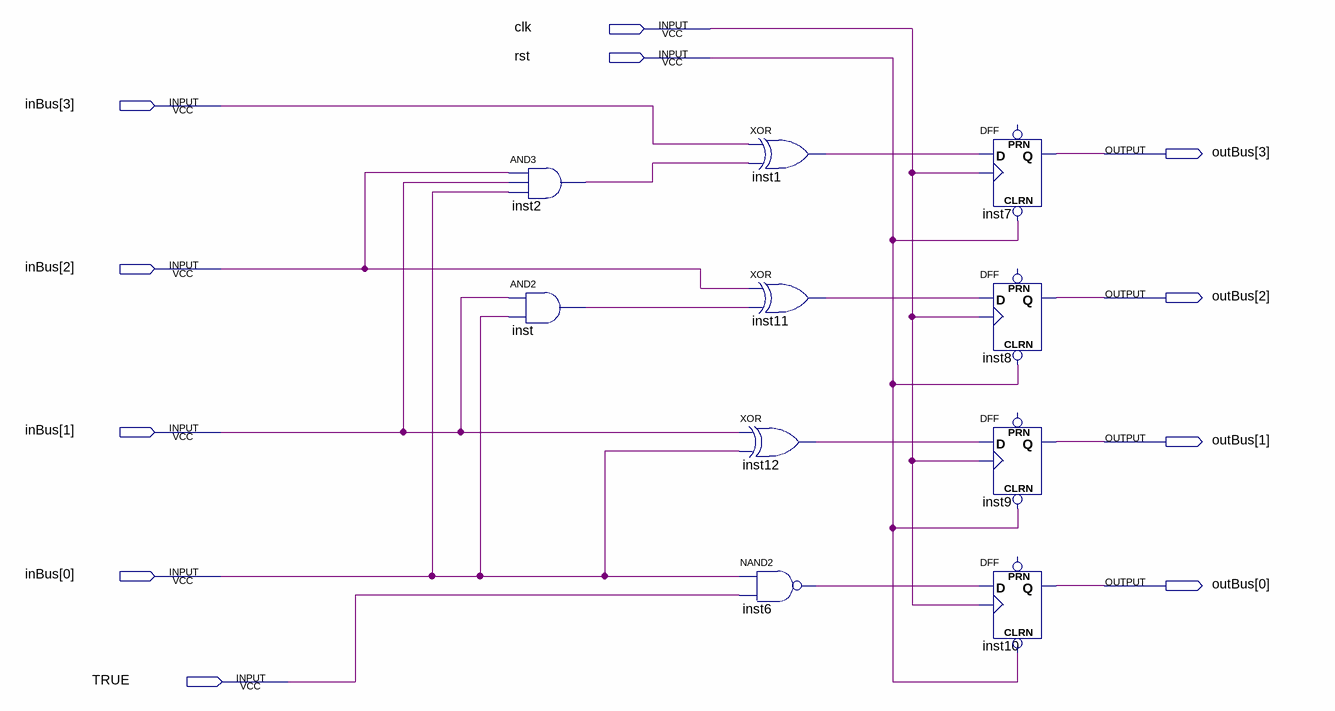
[diagram p0: schematic sheet]
// Quartus schematic Schematic_SynchUp.bdf as structural Verilog: 10 symbols, 11 pins
module Schematic_SynchUp (
  input  clk,
  input  rst,
  input  [3:0] inBus,
  input  TRUE,
  output [3:0] outBus
);

  wire inst1_out, inst2_out, inst6_out, inst11_out, inst12_out, inst_out;

  and inst2 (inst2_out, inBus[2], inBus[1], inBus[0]);
  and inst (inst_out, inBus[1], inBus[0]);
  xor inst1 (inst1_out, inBus[3], inst2_out);
  xor inst11 (inst11_out, inBus[2], inst_out);
  xor inst12 (inst12_out, inBus[1], inBus[0]);
  nand inst6 (inst6_out, inBus[0], TRUE);
  DFF inst7 (.CLRN(rst), .CLK(clk), .D(inst1_out), .Q(outBus[3]));  // open: PRN
  DFF inst8 (.CLRN(rst), .CLK(clk), .D(inst11_out), .Q(outBus[2]));  // open: PRN
  DFF inst9 (.CLRN(rst), .CLK(clk), .D(inst12_out), .Q(outBus[1]));  // open: PRN
  DFF inst10 (.CLRN(rst), .CLK(clk), .D(inst6_out), .Q(outBus[0]));  // open: PRN
endmodule
